# Altium schematic sheet S3220B4.SchDoc: BLE and peripheras
size A3; Revision: B; SheetNumber: 4; SheetTotal: 5
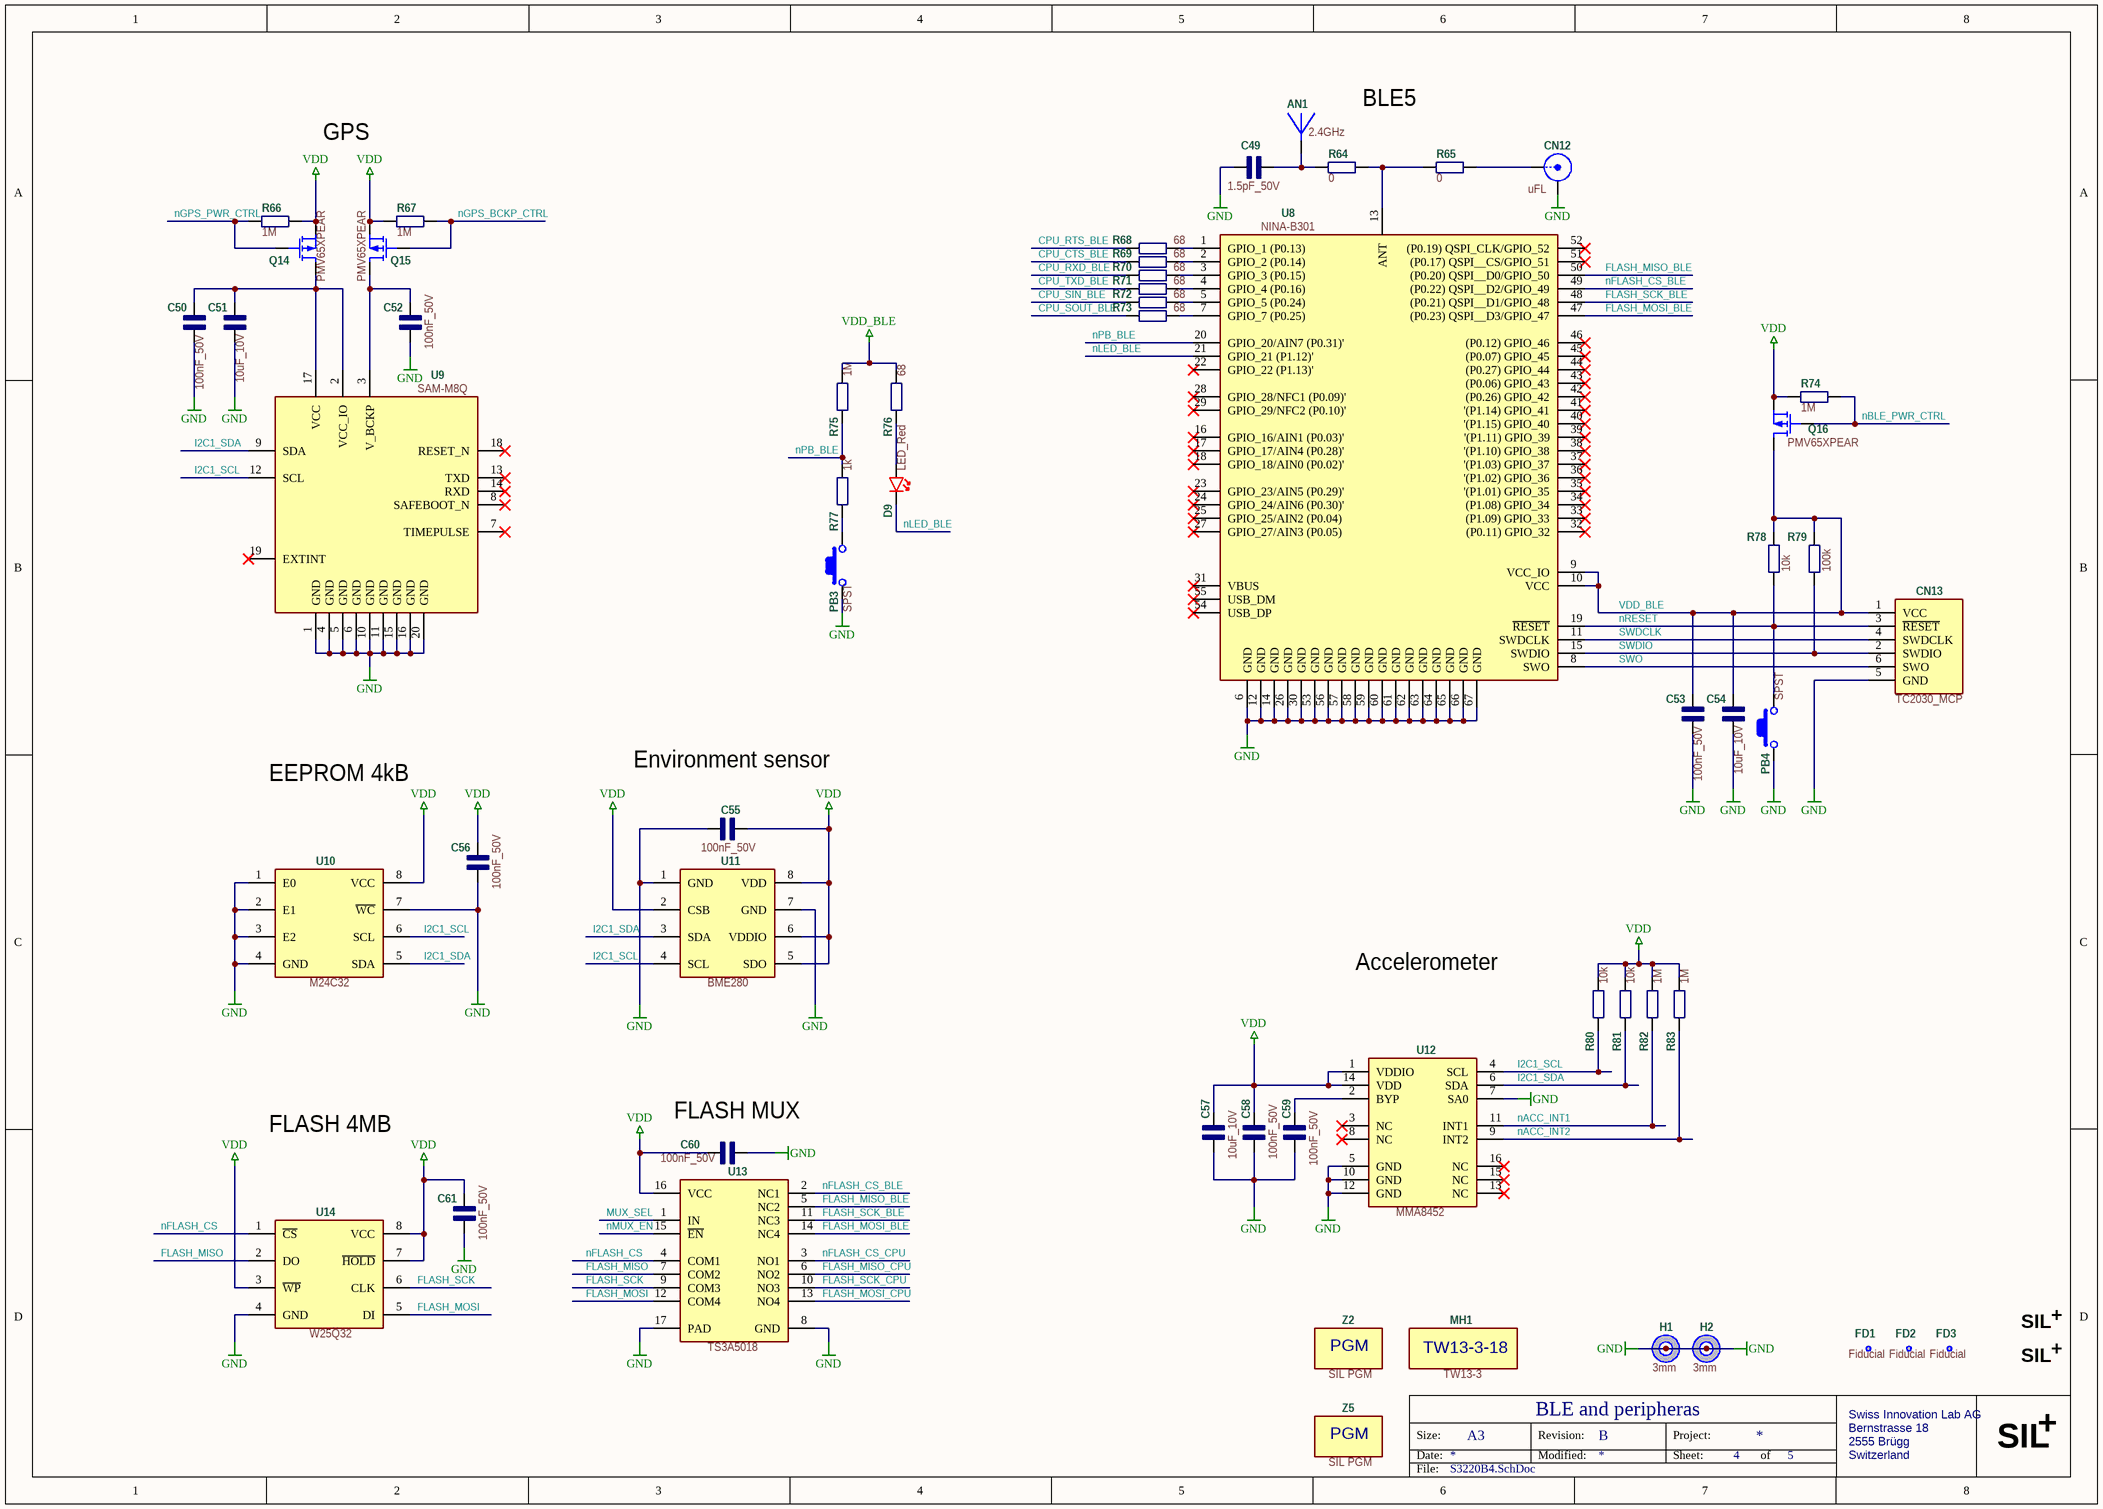
[diagram p0: S3220B4.SchDoc]

## Parts
AN1  2.4GHz  [AN_2400-PCB-B]  (no BOM)
C49  1.5pF_50V  [C_0603]
C50  100nF_50V  [C_0603]
C51  10uF_10V  [C_0603]
C52  100nF_50V  [C_0603]
C53  100nF_50V  [C_0603]
C54  10uF_10V  [C_0603]
C55  100nF_50V  [C_0603]
C56  100nF_50V  [C_0603]
C57  10uF_10V  [C_0603]
C58  100nF_50V  [C_0603]
C59  100nF_50V  [C_0603]
C60  100nF_50V  [C_0603]
C61  100nF_50V  [C_0603]
CN12  uFL  [CN_RF_uFL]
CN13  TC2030_MCP  [CN_TC2030-MCP-NL]  (no BOM)
D9  LED_Red  [LED_0603]
FD1  Fiducial  [FD_Fiducial]  (no BOM)
FD2  Fiducial  [FD_Fiducial]  (no BOM)
FD3  Fiducial  [FD_Fiducial]  (no BOM)
H1  3mm  [H_Hole_30M_55M]  (no BOM)
H2  3mm  [H_Hole_30M_55M]  (no BOM)
MH1  TW13-3  [MH_TW13-3]  (no BOM)
PB3  SPST  [PB_PTS810]
PB4  SPST  [PB_PTS810]
Q14  PMV65XPEAR  [U_SOT23-3]
Q15  PMV65XPEAR  [U_SOT23-3]
Q16  PMV65XPEAR  [U_SOT23-3]
R64  0  [R_0603]
R65  0  [R_0603]
R66  1M  [R_0603]
R67  1M  [R_0603]
R68  68  [R_0603]
R69  68  [R_0603]
R70  68  [R_0603]
R71  68  [R_0603]
R72  68  [R_0603]
R73  68  [R_0603]
R74  1M  [R_0603]
R75  1M  [R_0603]
R76  68  [R_0603]
R77  1k  [R_0603]
R78  10k  [R_0603]
R79  100k  [R_0603]
R80  10k  [R_0603]
R81  10k  [R_0603]
R82  1M  [R_0603]
R83  1M  [R_0603]
U8  NINA-B301  [U_NINA-B301]
U9  SAM-M8Q  [U_SAM-M8Q]
U10  M24C32  [U_8-SOIC_3.9]
U11  BME280  [U_BME280]
U12  MMA8452  [U_16-QFN-5X3]
U13  TS3A5018  [U_16-VFQFN]
U14  W25Q32  [U_8-SOIC_5.3]
Z2  SIL PGM  [Z_SIL-PGM]  (no BOM)
Z3  SIL logo  [Z_SIL-logo]  (value not drawn)  (no BOM)
Z4  SIL logo  [Z_SIL-logo]  (value not drawn)  (no BOM)
Z5  SIL PGM  [Z_SIL-PGM]  (no BOM)

## Nets
GND: C49.1 C50.1 C51.1 C52.1 C53.1 C54.1 C55.2 C56.1 C57.1 C58.2 C59.2 C60.2 C61.1 CN12.G CN13.5(GND) H1.0 H2.0 PB3.2 PB4.1 U8.6(GND) U8.12(GND) U8.14(GND) U8.26(GND) U8.30(GND) U8.53(GND) U8.56(GND) U8.57(GND) U8.58(GND) U8.59(GND) U8.60(GND) U8.61(GND) U8.62(GND) U8.63(GND) U8.64(GND) U8.65(GND) U8.66(GND) U8.67(GND) U9.1(GND) U9.4(GND) U9.5(GND) U9.6(GND) U9.10(GND) U9.11(GND) U9.15(GND) U9.16(GND) U9.20(GND) U10.1(E0) U10.2(E1) U10.3(E2) U10.4(GND) U10.7(~{WC}) U11.1(GND) U11.7(GND) U12.5(GND) U12.7(SA0) U12.10(GND) U12.12(GND) U13.8(GND) U13.17(PAD) U14.4(GND)
VDD: C55.1 C56.2 C57.2 C58.1 C60.1 C61.2 Q14.2(S) Q15.2(S) Q16.2(S) R66.2 R67.2 R74.2 R80.2 R81.2 R82.1 R83.1 U10.8(VCC) U11.2(CSB) U11.5(SDO) U11.6(VDDIO) U11.8(VDD) U12.1(VDDIO) U12.14(VDD) U13.16(VCC) U14.3(~{WP}) U14.7(~{HOLD}) U14.8(VCC)
VDD_BLE: C53.2 C54.2 CN13.1(VCC) Q16.3(D) R75.1 R76.2 R78.2 R79.2 U8.9(VCC_IO) U8.10(VCC)
CPU_CTS_BLE: R69.1
CPU_RTS_BLE: R68.1
CPU_RXD_BLE: R70.1
CPU_SIN_BLE: R72.1
CPU_SOUT_BLE: R73.1
CPU_TXD_BLE: R71.1
FLASH_MISO: U13.7(COM2) U14.2(DO)
FLASH_MISO_BLE: U8.50((P0.20)_QSPI__D0/GPIO_50) U13.5(NC2)
FLASH_MISO_CPU: U13.6(NO2)
FLASH_MOSI: U13.12(COM4) U14.5(DI)
FLASH_MOSI_BLE: U8.47((P0.23)_QSPI__D3/GPIO_47) U13.14(NC4)
FLASH_MOSI_CPU: U13.13(NO4)
FLASH_SCK: U13.9(COM3) U14.6(CLK)
FLASH_SCK_BLE: U8.48((P0.21)_QSPI__D1/GPIO_48) U13.11(NC3)
FLASH_SCK_CPU: U13.10(NO3)
I2C1_SCL: R80.1 U9.12(SCL) U10.6(SCL) U11.4(SCL) U12.4(SCL)
I2C1_SDA: R81.1 U9.9(SDA) U10.5(SDA) U11.3(SDA) U12.6(SDA)
MUX_SEL: U13.1(IN)
nACC_INT1: R82.2 U12.11(INT1)
nACC_INT2: R83.2 U12.9(INT2)
nBLE_PWR_CTRL: Q16.1(G) R74.1
nFLASH_CS: U13.4(COM1) U14.1(~{CS})
nFLASH_CS_BLE: U8.49((P0.22)_QSPI__D2/GPIO_49) U13.2(NC1)
nFLASH_CS_CPU: U13.3(NO1)
nGPS_BCKP_CTRL: Q15.1(G) R67.1
nGPS_PWR_CTRL: Q14.1(G) R66.1
nLED_BLE: D9.2(K) U8.21(GPIO_21_(P1.12)')
nMUX_EN: U13.15(~{EN})
nPB_BLE: R75.2 R77.2 U8.20(GPIO_20/AIN7_(P0.31)')
nRESET: CN13.3(~{RESET}) PB4.2 R78.1 U8.19(~{RESET})
SWDCLK: CN13.4(SWDCLK) U8.11(SWDCLK)
SWDIO: CN13.2(SWDIO) R79.1 U8.15(SWDIO)
SWO: CN13.6(SWO) U8.8(SWO)
NetAN1_1: AN1.1 C49.2 R64.1
NetC50_2: C50.2 C51.2 Q14.3(D) U9.2(VCC_IO) U9.17(VCC)
NetC52_2: C52.2 Q15.3(D) U9.3(V_BCKP)
NetC59_1: C59.1 U12.2(BYP)
NetCN12_S: CN12.S R65.2
NetD9_1: D9.1(A) R76.1
NetPB3_1: PB3.1 R77.1
NetR64_2: R64.2 R65.1 U8.13(ANT)
NetR68_2: R68.2 U8.1(GPIO_1_(P0.13))
NetR69_2: R69.2 U8.2(GPIO_2_(P0.14))
NetR70_2: R70.2 U8.3(GPIO_3_(P0.15))
NetR71_2: R71.2 U8.4(GPIO_4_(P0.16))
NetR72_2: R72.2 U8.5(GPIO_5_(P0.24))
NetR73_2: R73.2 U8.7(GPIO_7_(P0.25))

Not connected (* = marked no-connect by the designer): FD1 0; FD2 0; FD3 0; MH1 0; U8 16(GPIO_16/AIN1_(P0.03)')* 17(GPIO_17/AIN4_(P0.28)')* 18(GPIO_18/AIN0_(P0.02)')* 22(GPIO_22_(P1.13)')* 23(GPIO_23/AIN5_(P0.29)')* 24(GPIO_24/AIN6_(P0.30)')* 25(GPIO_25/AIN2_(P0.04))* 27(GPIO_27/AIN3_(P0.05))* 28(GPIO_28/NFC1_(P0.09)')* 29(GPIO_29/NFC2_(P0.10)')* 31(VBUS)* 32((P0.11)_GPIO_32)* 33((P1.09)_GPIO_33)* 34((P1.08)_GPIO_34)* 35('(P1.01)_GPIO_35)* 36('(P1.02)_GPIO_36)* 37('(P1.03)_GPIO_37)* 38('(P1.10)_GPIO_38)* 39('(P1.11)_GPIO_39)* 40('(P1.15)_GPIO_40)* 41('(P1.14)_GPIO_41)* 42((P0.26)_GPIO_42)* 43((P0.06)_GPIO_43)* 44((P0.27)_GPIO_44)* 45((P0.07)_GPIO_45)* 46((P0.12)_GPIO_46)* 51((P0.17)_QSPI__CS/GPIO_51)* 52((P0.19)_QSPI_CLK/GPIO_52)* 54(USB_DP)* 55(USB_DM)*; U9 7(TIMEPULSE)* 8(SAFEBOOT_N)* 13(TXD)* 14(RXD)* 18(RESET_N)* 19(EXTINT)*; U12 3(NC)* 8(NC)* 13(NC)* 15(NC)* 16(NC)*; Z2 0; Z3 0; Z4 0; Z5 0

## Notes on the sheet
- BLE5
- GPS
- EEPROM 4kB
- Environment sensor
- Accelerometer
- (near C60) FLASH MUX
- FLASH 4MB
- Size:
- Date:
- A3
- Revision:
- Modified:
- Project:
- Sheet:
- of
- Swiss Innovation Lab AG
- Bernstrasse 18
- 2555 Brügg
- Switzerland
- SIL
- +
- File:
- (in symbol MH_TW13-3) TW13-3-18
- (in symbol Z_PGM) PGM
- (in symbol Z_SIL_logo) +; SIL

## Library data of the parts
AN1 = AN_2.4GHz-PCB: 2.4 GHz PCB antenna; Manufacturer: Swiss Innovation Lab; Manufacturer Part Number: SIL AN24GHZ; Currency: $; Value: 2.4GHz; Price: 0; Supplier 1: SIL; Supplier Part Number 1: SIL AN24GHZ
C49 = C_1.5pF_50V: 1.5pF ±0.1pF 50V Ceramic Capacitor C0G, NP0 0603 (1608 Metric); Manufacturer: Samsung Electro-Mechanics; Manufacturer Part Number: CL10C1R5BB8NNNC; ValueAux: _50V; Currency: $; Value: 1.5pF; Price: 0,01291; Supplier 1: Digi-Key; Supplier Part Number 1: 1276-1071-1-ND
C50 C52 C53 C55 C56 C58-C61 = C_100nF_50V: 0.1µF ±10% 50V Ceramic Capacitor X7R 0603 (1608 Metric); Manufacturer: TDK; Manufacturer Part Number: C1608X7R1H104K080AA; Value: 100nF; ValueAux: _50V; Currency: $; Price: 0,01309; Supplier 1: Digi-Key; Supplier Part Number 1: 445-1314-6-ND
C51 C54 C57 = C_10uF_10V: 10µF ±10% 10V Ceramic Capacitor X5R 0603 (1608 Metric); Manufacturer: Murata Electronics North America; Manufacturer Part Number: GRM188R61A106KE69D; Value: 10uF; ValueAux: _10V; Currency: $; Price: 0,03994; Supplier 1: Digi-Key; Supplier Part Number 1: 490-10474-1-ND
CN12 = CN_RF_uFL: Ultra Miniature Coaxial Connector Jack, Male Pin 50 Ohm Surface Mount Solder; Manufacturer: TE Connectivity AMP Connectors; Manufacturer Part Number: 1909763-1; Currency: $; Value: uFL; Price: 0,25410; Supplier 1: Digi-Key; Supplier Part Number 1: A118077CT-ND
CN13 = CN_TC2030: TC2030-MCP-NL; Value: TC2030; ValueAux: _MCP; Currency: $; Price: 0
D9 = D_LED_R_5mA: Red 631nm LED Indication - Discrete 2V 0603; Manufacturer: Lite-On Inc.; Manufacturer Part Number: LTST-C193KRKT-5A; ValueAux: _Red; Currency: $; Value: LED; Price: 0,07565; Supplier 1: Digi-Key; Supplier Part Number 1: 160-1830-1-ND
FD1-FD3 = FD_Fiducial: Reference point for assembly machine; Manufacturer: Swiss Innovation Lab; Currency: $; Value: Fiducial; Manufacturer Part Number: Fiducial; Price: 0; Supplier 1: Swiss Innovation Lab; Supplier Part Number 1: Fiducial
H1 H2 = H_Hole_3M_55M: Hole 3mm, Pad 5.5mm; Manufacturer: Swiss Innovation Lab; Currency: $; Value: 3mm; Manufacturer Part Number: Hole 3mm; Price: 0; Supplier 1: Swiss Innovation Lab; Supplier Part Number 1: Hole 3mm
MH1 = MH_TW13-3: Case Takachi TW13-3; Currency: $; Value: TW13-3; Manufacturer: Takachi; Manufacturer Part Number: TW13-3; Price: 0
PB3 PB4 = PB_SPST_2.5mm: Tactile Switch SPST-NO Top Actuated Surface Mount; Manufacturer: C&K; Manufacturer Part Number: PTS810 SJM 250 SMTR LFS; Currency: $; Value: SPST; Price: 0,17302; Supplier 1: Digi-Key; Supplier Part Number 1: CKN10502DKR-ND
Q14-Q16 = Q_PMV65: P-Channel 20V 2.8A (Ta) 480mW (Ta), 6.25W (Tc) Surface Mount TO-236AB (SOT23); Manufacturer: Nexperia USA Inc.; Currency: $; Value: PMV65XPEAR; Manufacturer Part Number: PMV65XPEAR; Price: 0,11204; Supplier 1: Digi-Key; Supplier Part Number 1: 1727-2310-1-ND
R64 R65 = R_0_1%: 0 Ohms Jumper 0.1W, 1/10W Chip Resistor 0603 (1608 Metric) Automotive AEC-Q200 Thick Film; Manufacturer: Panasonic Electronic Components; Manufacturer Part Number: ERJ-3GEY0R00V; Currency: $; Value: 0; Price: 0,00962; Supplier 1: Digi-Key; Supplier Part Number 1: P0.0GCT-ND
R66 R67 R74 R75 R82 R83 = R_1M_1%: 1 MOhms ±1% 0.1W, 1/10W Chip Resistor 0603 (1608 Metric) Automotive AEC-Q200 Thick Film; Manufacturer: Panasonic Electronic Components; Manufacturer Part Number: ERJ-3EKF1004V; Currency: $; Value: 1M; Price: 0,01264; Supplier 1: Digi-Key; Supplier Part Number 1: P1.00MHCT-ND
R68-R73 R76 = R_68_1%: 68 Ohms ±1% 0.1W, 1/10W Chip Resistor 0603 (1608 Metric) Automotive AEC-Q200 Thick Film; Manufacturer: Panasonic Electronic Components; Manufacturer Part Number: ERJ-3EKF68R0V; Currency: $; Value: 68; Price: 0,01449; Supplier 1: Digi-Key; Supplier Part Number 1: P68.0HCT-ND
R77 = R_1k_1%: 1 kOhms ±1% 0.1W, 1/10W Chip Resistor 0603 (1608 Metric) Automotive AEC-Q200 Thick Film; Manufacturer: Panasonic Electronic Components; Manufacturer Part Number: ERJ-3EKF1001V; Currency: $; Value: 1k; Price: 0,01153; Supplier 1: Digi-Key; Supplier Part Number 1: P1.00KHCT-ND
R78 R80 R81 = R_10k_1%: 10 kOhms ±1% 0.1W, 1/10W Chip Resistor 0603 (1608 Metric) Automotive AEC-Q200 Thick Film; Manufacturer: Panasonic Electronic Components; Manufacturer Part Number: ERJ-3EKF1002V; Currency: $; Value: 10k; Price: 0,01449; Supplier 1: Digi-Key; Supplier Part Number 1: P10.0KHCT-ND
R79 = R_100k_1%: 100 kOhms ±1% 0.1W, 1/10W Chip Resistor 0603 (1608 Metric) Automotive AEC-Q200 Thick Film; Manufacturer: Panasonic Electronic Components; Manufacturer Part Number: ERJ-3EKF1003V; Currency: $; Value: 100k; Price: 0,01367; Supplier 1: Digi-Key; Supplier Part Number 1: P100KHCT-ND
U8 = U_NINA-B301: MOD BLE 4.2 NORDIC NRF52840 SOC; Manufacturer: uBlox; Currency: $; Value: NINA-B301; Manufacturer Part Number: NINA-B301; Price: 7,5; Supplier 1: uBlox; Supplier Part Number 1: NINA-B301
U9 = U_SAM-M8Q: SAM-M8Q RF Receiver Galileo, GLONASS, GPS 1.575GHz, 1.602GHz -165dBm 400kbps; Manufacturer: U-Blox America Inc.; Manufacturer Part Number: SAM-M8Q-0-10; Currency: $; Value: SAM-M8Q; Price: 12,75120; Supplier 1: Digi-Key; Supplier Part Number 1: 672-1054-1-ND
U10 = U_M24C32: EEPROM Memory IC 32Kb (4K x 8) I2C 1MHz 450ns 8-SO; Manufacturer: STMicroelectronics; Manufacturer Part Number: M24C32-WMN6TP; Currency: $; Value: M24C32; Price: 0,18324; Supplier 1: Digi-Key; Supplier Part Number 1: 497-5027-1-ND
U11 = U_BME280: Humidity Temperature Sensor 0 ~ 100% RH I2C, SPI ±3% 1s Surface Mount; Manufacturer: Bosch Sensortec; Currency: $; Value: BME280; Manufacturer Part Number: BME280; Price: 3,71140; Supplier 1: Digi-Key; Supplier Part Number 1: 828-1063-1-ND
U12 = U_MMA8452: Accelerometer X, Y, Z Axis ±2g, 4g, 8g 0.78Hz ~ 400Hz 16-QFN (3x3); Manufacturer: NXP USA Inc.; Manufacturer Part Number: MMA8452QT; Currency: $; Value: MMA8452; Price: 1,09888; Supplier 1: Digi-Key; Supplier Part Number 1: MMA8452QT-ND
U13 = U_TS3A5018: 4 Circuit IC Switch 2:1 10Ohm 16-UQFN (2.6x1.8); Manufacturer: Texas Instruments; Manufacturer Part Number: TS3A5018RGYR; Currency: $; Value: TS3A5018; Price: 0,25928; Supplier 1: Digi-Key; Supplier Part Number 1: 296-19899-1-ND
U14 = U_W25Q32: FLASH - NOR Memory IC 32Mb (4M x 8) SPI - Quad I/O 133MHz  8-SOIC; Manufacturer: Winbond Electronics; Manufacturer Part Number: W25Q32JVSSIQ; Currency: $; Value: W25Q32; Price: 0,97; Supplier 1: Digi-Key; Supplier Part Number 1: W25Q32JVSSIQ-ND
Z2 Z5 = Z_PGM: Programmer Template; Manufacturer: Swiss Innovation Lab; Currency: $; Value: SIL PGM; Manufacturer Part Number: SIL PGM; Price: 0
Z3 Z4 = Z_SIL_logo: Manufacturer: Swiss Innovation Lab; Currency: $; Value: SIL logo; Manufacturer Part Number: SIL Logo; Price: 0; Supplier 1: Swiss Innovation Lab; Supplier Part Number 1: SIL Logo